# Altium project foxbms2-master.PrjPcb (part 5 of 7)

## Sheet io-devices.SchDoc
size A3; DocumentNumber: 15; SheetNumber: 15; SheetTotal: 45; SheetDescription: Smart Switches, Isolation Monitoring
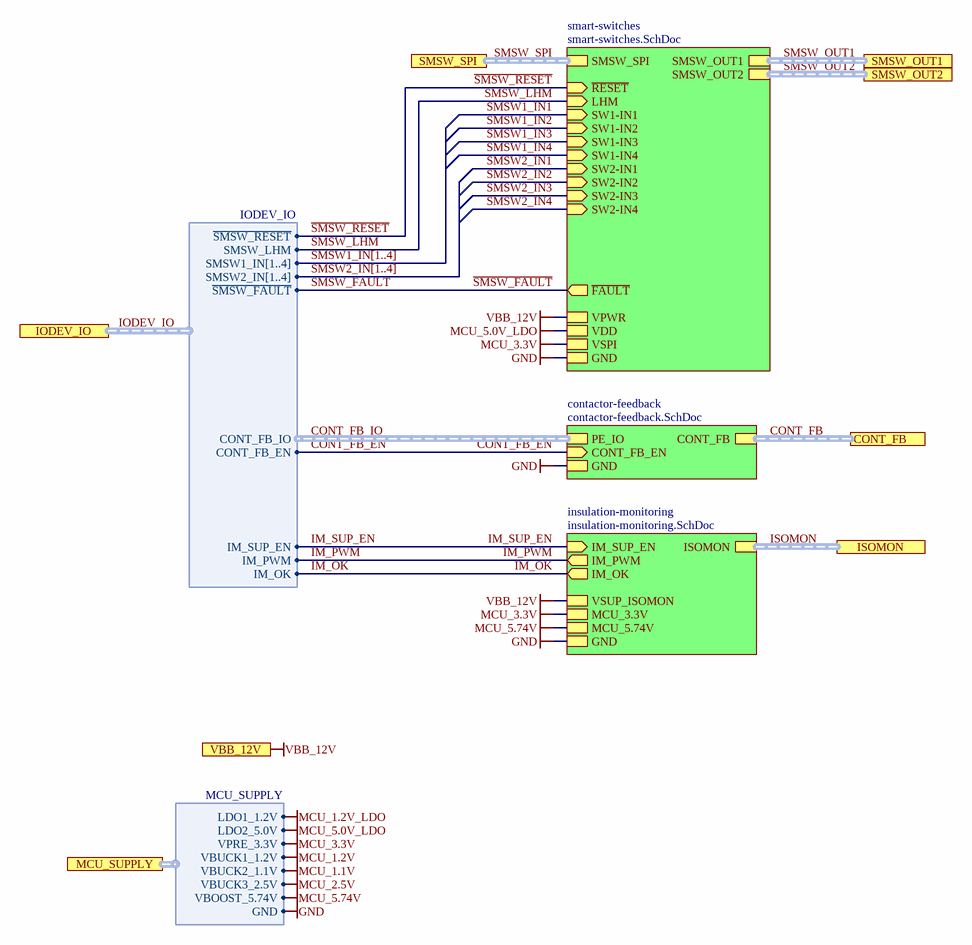
[diagram p16: io-devices.SchDoc]

### Sub-sheets
contactor-feedback = contactor-feedback.SchDoc (file not in this document): PE_IO (harness PE_IO), CONT_FB (harness PE_IO), GND, CONT_FB_EN (in)
insulation-monitoring = insulation-monitoring.SchDoc (file not in this document): GND, IM_SUP_EN (in), ISOMON (harness ISOMON), VSUP_ISOMON, IM_PWM (out), IM_OK (out), MCU_3.3V, MCU_5.74V
smart-switches = smart-switches.SchDoc (file not in this document): ~{RESET} (in), LHM (in), ~{FAULT} (out), SMSW_SPI (harness SPI), SMSW_OUT2 (harness SMSW_OUT), SMSW_OUT1 (harness SMSW_OUT), SW1-IN4 (in), SW2-IN2 (in), SW1-IN1 (in), SW2-IN3 (in), SW1-IN3 (in), SW1-IN2 (in), SW2-IN4 (in), SW2-IN1 (in), GND, VDD, VPWR, VSPI

### Ports
CONT_FB (harness PE_IO), IODEV_IO (harness IODEV_IO), ISOMON (harness ISOMON), MCU_SUPPLY (harness MCU_SUPPLY), SMSW_OUT1 (harness SMSW_OUT), SMSW_OUT2 (harness SMSW_OUT), SMSW_SPI (harness SPI), VBB_12V

### Harnesses
IODEV_IO: ~{SMSW_RESET}, SMSW_LHM, ~{SMSW_FAULT}, CONT_FB_IO, CONT_FB_EN, IM_SUP_EN, IM_PWM, IM_OK, SMSW1_IN[1..4], SMSW2_IN[1..4]
MCU_SUPPLY: VBUCK1_1.2V, VBUCK2_1.1V, VBUCK3_2.5V, LDO1_1.2V, LDO2_5.0V, GND, VPRE_3.3V, VBOOST_5.74V

### Nets
GND: sheet smart-switches/GND, sheet contactor-feedback/GND, sheet insulation-monitoring/GND, port MCU_SUPPLY.GND
MCU_3.3V: sheet smart-switches/VSPI, sheet insulation-monitoring/MCU_3.3V, port MCU_SUPPLY.VPRE_3.3V
MCU_5.0V_LDO: sheet smart-switches/VDD, port MCU_SUPPLY.LDO2_5.0V
MCU_5.74V: sheet insulation-monitoring/MCU_5.74V, port MCU_SUPPLY.VBOOST_5.74V
VBB_12V: port VBB_12V, sheet smart-switches/VPWR, sheet insulation-monitoring/VSUP_ISOMON
~{SMSW_FAULT}: sheet smart-switches/~{FAULT}, port IODEV_IO.~{SMSW_FAULT}  [project net IODEV_IO~{.}SMSW_FAULT]
~{SMSW_RESET}: sheet smart-switches/~{RESET}, port IODEV_IO.~{SMSW_RESET}  [project net IODEV_IO~{.}SMSW_RESET]
CONT_FB_EN: sheet contactor-feedback/CONT_FB_EN, port IODEV_IO.CONT_FB_EN  [project net IODEV_IO.CONT_FB_EN]
IM_OK: sheet insulation-monitoring/IM_OK, port IODEV_IO.IM_OK  [project net IODEV_IO.IM_OK]
IM_PWM: sheet insulation-monitoring/IM_PWM, port IODEV_IO.IM_PWM  [project net IODEV_IO.IM_PWM]
IM_SUP_EN: sheet insulation-monitoring/IM_SUP_EN, port IODEV_IO.IM_SUP_EN  [project net IODEV_IO.IM_SUP_EN]
SMSW_LHM: sheet smart-switches/LHM, port IODEV_IO.SMSW_LHM  [project net EXT_CON.SMSW_LHM]

### Buses and harness runs
bus SMSW1_IN[1..4]
bus SMSW2_IN[1..4]
harness CONT_FB = port CONT_FB = sheet contactor-feedback/CONT_FB
harness CONT_FB_IO = sheet contactor-feedback/PE_IO
harness IODEV_IO = port IODEV_IO
harness ISOMON = port ISOMON = sheet insulation-monitoring/ISOMON
harness SMSW_OUT1 = port SMSW_OUT1 = sheet smart-switches/SMSW_OUT1
harness SMSW_OUT2 = port SMSW_OUT2 = sheet smart-switches/SMSW_OUT2
harness SMSW_SPI = port SMSW_SPI = sheet smart-switches/SMSW_SPI

### Notes on the sheet
- Fraunhofer IISB
- Schottkystr. 10
- developed by:
- 91058 Erlangen
- Germany
- Author
- Project
- License
- Description
- File
- Version
- Release Date
- Sheet
- foxbms.org <https://foxbms.org>
- www.iisb.fraunhofer.de <https://www.iisb.fraunhofer.de/>
- foxBMS Team
- /

## Sheet supply.SchDoc
size A3; DocumentNumber: 41; SheetNumber: 41; SheetTotal: 45; SheetDescription: Board Power Supply
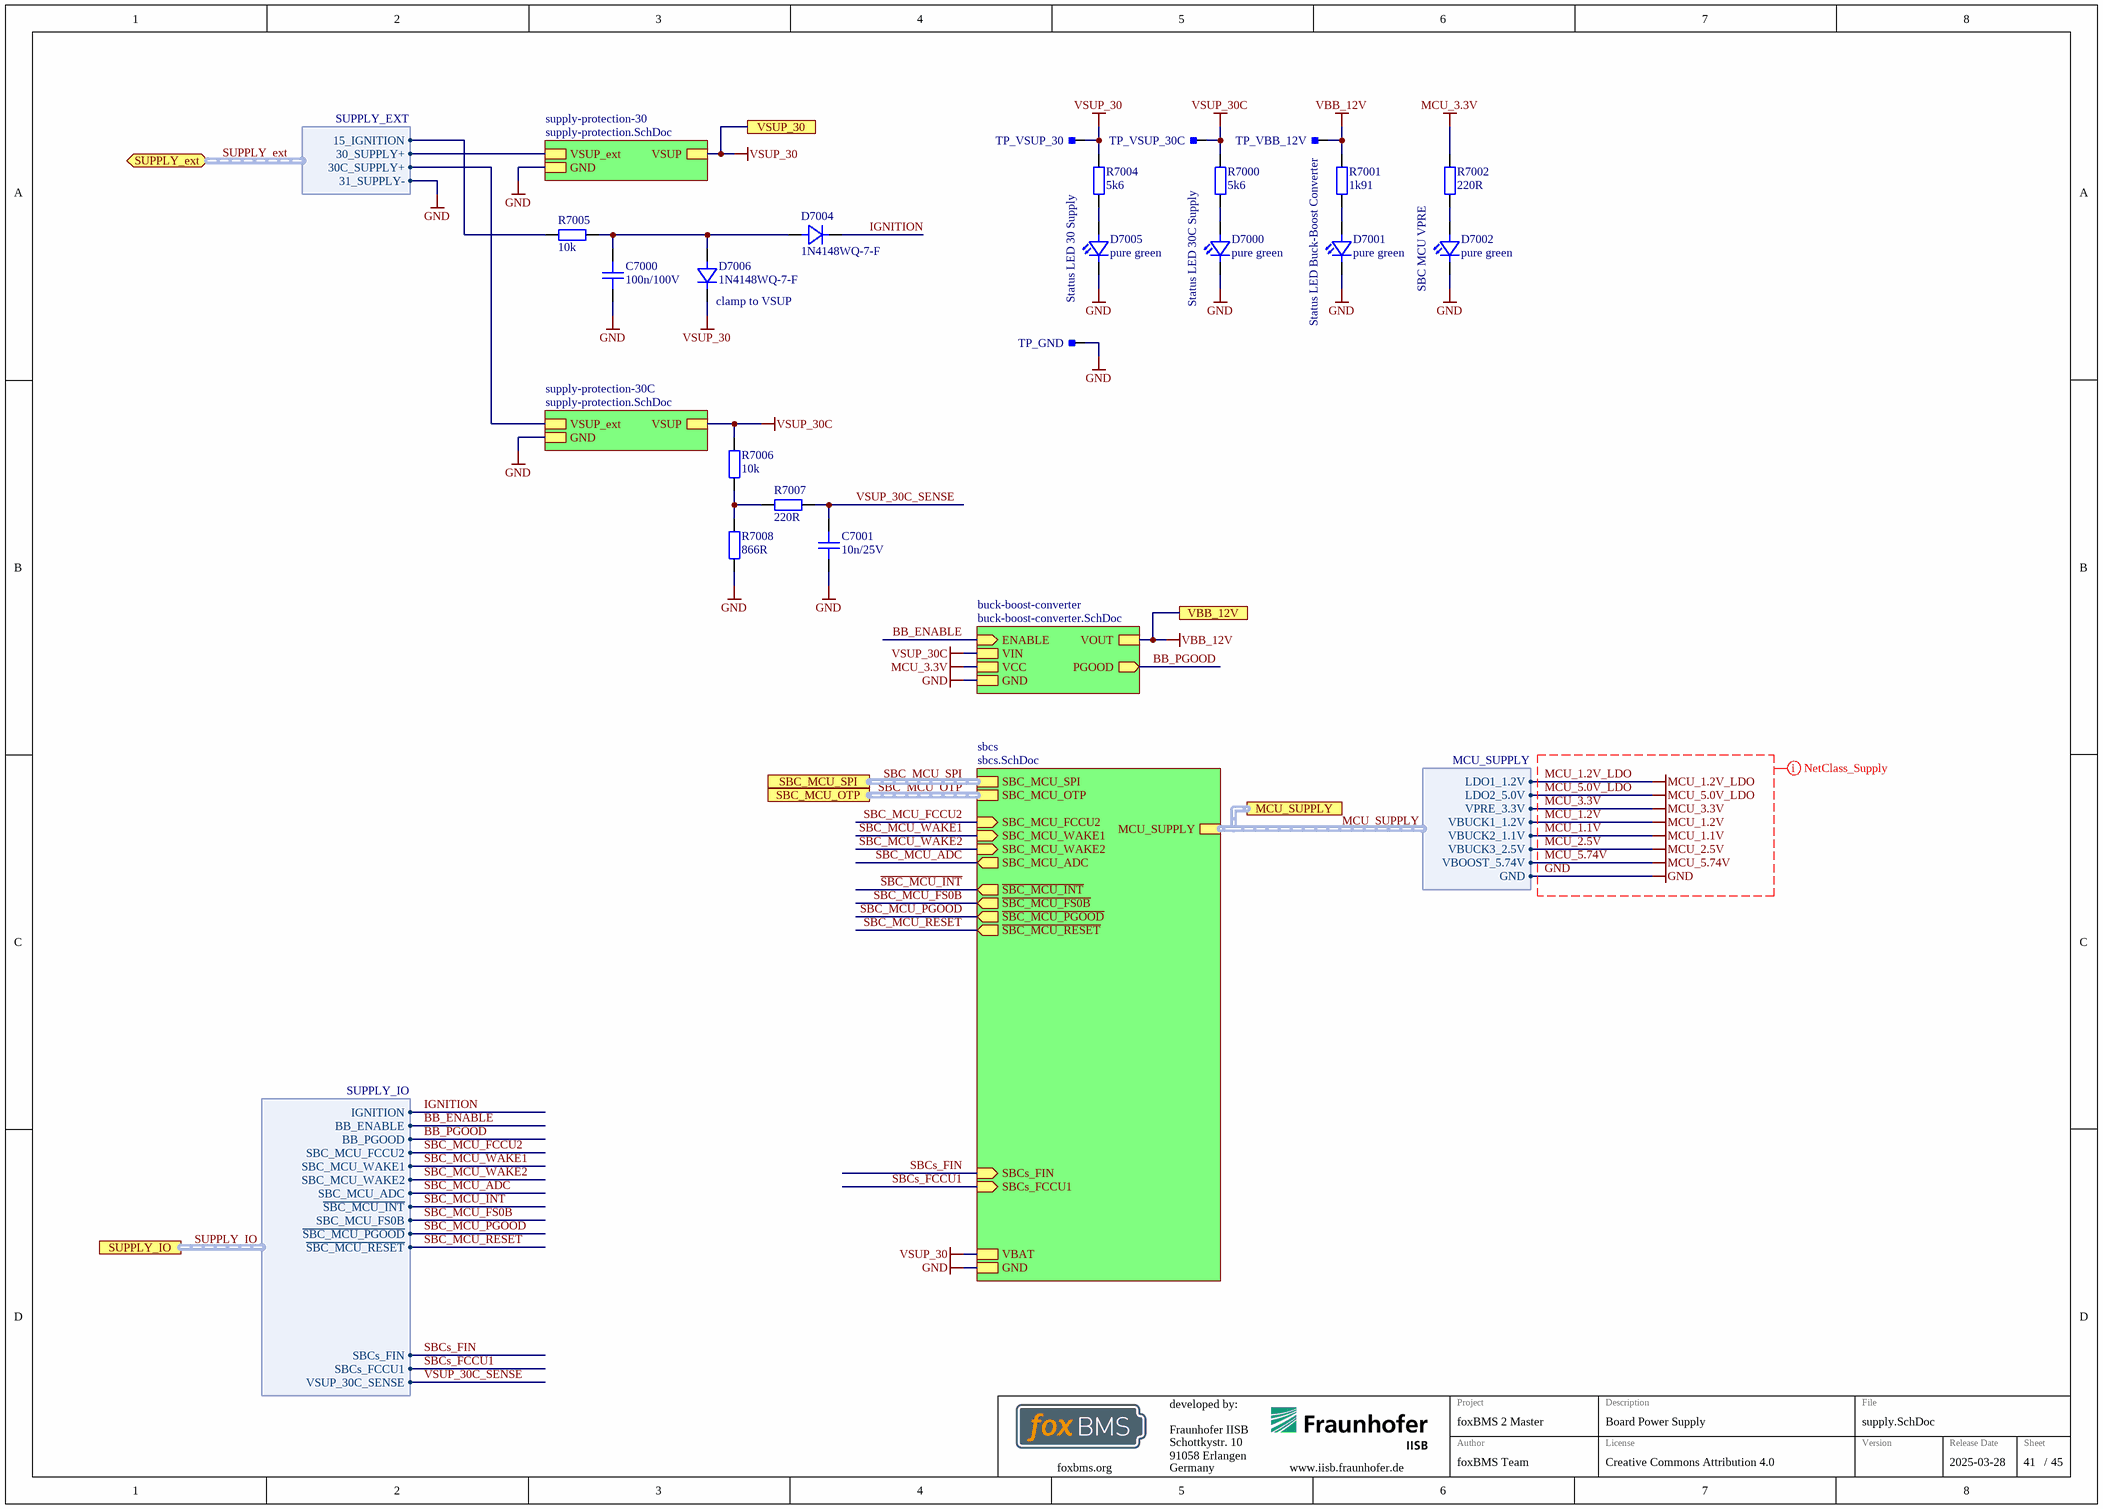
[diagram p17: supply.SchDoc]

### Parts
C7000  100n/100V  [CAPC1608X08N]
C7001  10n/25V  [CAPC1005X06N]
D7000  pure green  [LEDC1608X07N]
D7001  pure green  [LEDC1608X07N]
D7002  pure green  [LEDC1608X07N]
D7004  1N4148WQ-7-F  [SOD-123_CASE-425-04-ISSUE-G]
D7005  pure green  [LEDC1608X07N]
D7006  1N4148WQ-7-F  [SOD-123_CASE-425-04-ISSUE-G]
R7000  5k6  [RESC1005X04N]
R7001  1k91  [RESC1005X04N]
R7002  220R  [RESC1005X04N]
R7004  5k6  [RESC1005X04N]
R7005  10k  [RESC1005X04N]
R7006  10k  [RESC1005X04N]
R7007  220R  [RESC1005X04N]
R7008  866R  [RESC1005X04N]
TP_GND  Testpoint_Square  [Testpoint_S1]  (value not drawn)  (no BOM)
TP_VBB_12V  Testpoint_Square  [Testpoint_S1]  (value not drawn)  (no BOM)
TP_VSUP_30  Testpoint_Square  [Testpoint_S1]  (value not drawn)  (no BOM)
TP_VSUP_30C  Testpoint_Square  [Testpoint_S1]  (value not drawn)  (no BOM)

### Sub-sheets
buck-boost-converter = buck-boost-converter.SchDoc (file not in this document): VIN, VOUT, PGOOD (out), GND, VCC, ENABLE (in)
sbcs = sbcs.SchDoc: VBAT, GND, SBC_MCU_SPI (harness SPI), SBC_MCU_WAKE2 (in), SBC_MCU_FCCU2 (in), ~{SBC_MCU_FS0B} (out), SBC_MCU_ADC (out), ~{SBC_MCU_INT} (out), MCU_SUPPLY (harness MCU_SUPPLY), SBC_MCU_OTP (harness SBC_OTP), SBC_MCU_WAKE1 (in), SBCs_FIN (in), ~{SBC_MCU_PGOOD} (out), ~{SBC_MCU_RESET} (out), SBCs_FCCU1 (in)
supply-protection-30 = supply-protection.SchDoc (file not in this document): VSUP, GND, VSUP_ext
supply-protection-30C = supply-protection.SchDoc (file not in this document): VSUP, GND, VSUP_ext

### Ports
MCU_SUPPLY (harness MCU_SUPPLY), SBC_MCU_OTP (harness SBC_OTP), SBC_MCU_SPI (harness SPI), SUPPLY_ext (bidir, harness SUPPLY_EXT), SUPPLY_IO (harness SUPPLY_IO), VBB_12V, VSUP_30

### Harnesses
MCU_SUPPLY: VBUCK1_1.2V, VBUCK2_1.1V, VBUCK3_2.5V, LDO1_1.2V, LDO2_5.0V, GND, VPRE_3.3V, VBOOST_5.74V
SUPPLY_IO: IGNITION, BB_ENABLE, BB_PGOOD, SBC_MCU_FCCU2, SBC_MCU_WAKE1, SBC_MCU_WAKE2, SBC_MCU_ADC, ~{SBC_MCU_INT}, SBC_MCU_FS0B, ~{SBC_MCU_PGOOD}, ~{SBC_MCU_RESET}, SBCs_FIN, SBCs_FCCU1, VSUP_30C_SENSE
SUPPLY_EXT: 30_SUPPLY+, 31_SUPPLY-, 15_IGNITION, 30C_SUPPLY+

### Nets
GND: C7000.1 C7001.1 D7000.1(C) D7001.1(C) D7002.1(C) D7005.1(C) R7008.1 TP_GND.1 ; sheet buck-boost-converter/GND, sheet supply-protection-30/GND, sheet sbcs/GND, sheet supply-protection-30C/GND, port MCU_SUPPLY.GND, port SUPPLY_ext.31_SUPPLY-
MCU_3.3V: R7002.2 ; sheet buck-boost-converter/VCC, port MCU_SUPPLY.VPRE_3.3V
VBB_12V: R7001.2 TP_VBB_12V.1 ; port VBB_12V, sheet buck-boost-converter/VOUT
VSUP_30: D7006.1(K) R7004.2 TP_VSUP_30.1 ; port VSUP_30, sheet supply-protection-30/VSUP, sheet sbcs/VBAT
VSUP_30C: R7000.2 R7006.2 TP_VSUP_30C.1 ; sheet buck-boost-converter/VIN, sheet supply-protection-30C/VSUP
~{SBC_MCU_INT}: sheet sbcs/~{SBC_MCU_INT}, port SUPPLY_IO.~{SBC_MCU_INT}  [project net MCU_GIOA.0]
~{SBC_MCU_PGOOD}: sheet sbcs/~{SBC_MCU_PGOOD}, port SUPPLY_IO.~{SBC_MCU_PGOOD}  [project net EXT_CON~{.}SBC_MCU_PGOOD]
~{SBC_MCU_RESET}: sheet sbcs/~{SBC_MCU_RESET}, port SUPPLY_IO.~{SBC_MCU_RESET}  [project net EXT_CON~{.}SBC_MCU_RESET]
BB_ENABLE: sheet buck-boost-converter/ENABLE, port SUPPLY_IO.BB_ENABLE  [project net MCU_GIOX.T6]
BB_PGOOD: sheet buck-boost-converter/PGOOD, port SUPPLY_IO.BB_PGOOD  [project net MCU_GIOB.7]
IGNITION: D7004.1(K) ; sheet sbcs/SBC_MCU_WAKE1, port SUPPLY_IO.IGNITION, port SUPPLY_IO.SBC_MCU_WAKE1  [also labelled SBC_MCU_WAKE1]  [project net SUPPLY_IO.IGNITION]
SBC_MCU_ADC: sheet sbcs/SBC_MCU_ADC, port SUPPLY_IO.SBC_MCU_ADC  [project net SUPPLY_IO.SBC_MCU_ADC]
SBC_MCU_FCCU2: sheet sbcs/SBC_MCU_FCCU2, port SUPPLY_IO.SBC_MCU_FCCU2  [project net MCU_GIOX.T7]
SBC_MCU_FS0B: sheet sbcs/~{SBC_MCU_FS0B}, port SUPPLY_IO.SBC_MCU_FS0B  [project net EXT_CON.SBC_MCU_FS0B]
SBC_MCU_WAKE2: sheet sbcs/SBC_MCU_WAKE2, port SUPPLY_IO.SBC_MCU_WAKE2  [project net SUPPLY_IO.SBC_MCU_WAKE2]
SBCs_FCCU1: sheet sbcs/SBCs_FCCU1, port SUPPLY_IO.SBCs_FCCU1  [project net MCU_RST~{.}ERROR]
SBCs_FIN: sheet sbcs/SBCs_FIN, port SUPPLY_IO.SBCs_FIN  [project net MCU_CLK.2.22MHz]
SUPPLY_ext.15_IGNITION: R7005.2 ; port SUPPLY_ext.15_IGNITION
SUPPLY_ext.30_SUPPLY+: sheet supply-protection-30/VSUP_ext, port SUPPLY_ext.30_SUPPLY+
SUPPLY_ext.30C_SUPPLY+: sheet supply-protection-30C/VSUP_ext, port SUPPLY_ext.30C_SUPPLY+
VSUP_30C_SENSE: C7001.2 R7007.2 ; port SUPPLY_IO.VSUP_30C_SENSE  [project net SUPPLY_IO.VSUP_30C_SENSE]
NetC7000_2: C7000.2 D7004.2(A) D7006.2(A) R7005.1
NetD7000_2: D7000.2(A) R7000.1
NetD7001_2: D7001.2(A) R7001.1
NetD7002_2: D7002.2(A) R7002.1
NetD7005_2: D7005.2(A) R7004.1
NetR7006_1: R7006.1 R7007.1 R7008.2

### Buses and harness runs
harness MCU_SUPPLY = port MCU_SUPPLY = sheet sbcs/MCU_SUPPLY
harness SBC_MCU_OTP = port SBC_MCU_OTP = sheet sbcs/SBC_MCU_OTP
harness SBC_MCU_SPI = port SBC_MCU_SPI = sheet sbcs/SBC_MCU_SPI
harness SUPPLY_ext = port SUPPLY_ext
harness SUPPLY_IO = port SUPPLY_IO

### Layout directives
net class Supply_All: GND, MCU_1.1V, MCU_1.2V, MCU_1.2V_LDO, MCU_2.5V, MCU_3.3V, MCU_5.0V_LDO, MCU_5.74V

### Notes on the sheet
- Status LED 30 Supply
- Status LED 30C Supply
- (near TP_VBB_12V) Status LED Buck-Boost Converter
- SBC MCU VPRE
- (near D7006) clamp to VSUP
- Fraunhofer IISB
- Schottkystr. 10
- developed by:
- 91058 Erlangen
- Germany
- Author
- Project
- License
- Description
- File
- Version
- Release Date
- Sheet
- foxbms.org <https://foxbms.org>
- www.iisb.fraunhofer.de <https://www.iisb.fraunhofer.de/>
- foxBMS Team
- /

### Library data of the parts
C7000 = gen_C_ceramic_100n_100V_X7R_0603: MLCC; Capacitance: 100n; Rated Voltage: 100V; Dielectric: X7R; Case EIA: 0603; Case Metric: 1608; Automotive Qualified: True; PnP Package: 0603C; Part Number: gen_C_ceramic_100n_100V_X7R_0603; Supplier 1: Digikey; Supplier Part Number 1: 490-13420-1-ND; Supplier 2: Mouser; Supplier Part Number 2: 81-GCJ188R72A104KA1D
C7001 = gen_C_ceramic_10n_25V_X7R_0402: MLCC; Capacitance: 10n; Rated Voltage: 25V; Dielectric: X7R; Case EIA: 0402; Case Metric: 1005; PnP Package: 0402C; PnP Value: 10nF/25V/X7R; PnP equipped: x; Automotive Qualified: True; Part Number: gen_C_ceramic_10n_25V_X7R_0402; Supplier 1: Farnell; Supplier Part Number 1: 2210793
D7000-D7002 D7005 = LED_0603_pure_green_AECQ: TLMP1100-GS08; Manufacturer: Vishay; Breakdown Voltage: 5V; Continuous Forward Current: 20mA; Forward Voltage @ 20mA: 2.1V; Automotive Qualified: True; Part Number: LED_0603_pure_green_AECQ; Color: pure green; Operating Temperature: -40°C - 100°C; ComponentLink1Description: Datasheet; ComponentLink1URL: http://www.farnell.com/datasheets/2049164.pdf; Supplier 1: Farnell; Supplier Part Number 1: 1328306; Supplier 2: Digikey; Supplier Part Number 2: 751-1176-1-ND; PnP Package: LED_0603
D7004 D7006 = 1N4148WQ-7-F: Diode; Manufacturer: Diodes Inc.; Breakdown Voltage: 100V; Continuous Forward Current: 300mA; PnP Package: SOD123; Automotive Qualified: True; Part Number: 1N4148WQ-7-F; Part Name: 1N4148WQ-7-F; Operating Temperature: -65°C - +150°C; ComponentLink1Description: Datasheet; ComponentLink1URL: https://www.diodes.com/assets/Datasheets/ds30086.pdf; Supplier 1: Digikey; Supplier Part Number 1: 1N4148WQ-7-FDICT-ND
R7000 R7004 = gen_R_5k6_0402: SMD Resistor 5k6 0402; Tolerance: 1%; Power: 0.063W; Case EIA: 0402; Case Metric: 1005; Maximum Working Voltage: 50V; PnP Package: 0402R; Automotive Qualified: True; AEC-Q Norm: AEC-Q200; AEC-Q Grade: Grade 0; Part Number: gen_R_5k6_0402; Operating Temperature: -55°C - +155°C; Resistance: 5k6; Series: E24; PnP Value: 5k6; Supplier 1: Digikey; Supplier Part Number 1: A129636CT-ND; ECCN: EAR99
R7001 = gen_R_1k91_0402: SMD Resistor 1k91 0402; Tolerance: 1%; Power: 0.063W; Case EIA: 0402; Case Metric: 1005; Maximum Working Voltage: 50V; PnP Package: 0402R; Automotive Qualified: True; AEC-Q Grade: Grade 0; AEC-Q Norm: AEC-Q200; Part Number: gen_R_1k91_0402; Operating Temperature: -55°C - +155°C; Resistance: 1k91; Series: E96; PnP Value: 1k91; ECCN: EAR99; Supplier 1: Digikey; Supplier Part Number 1: P1.91KLCT-ND
R7002 = gen_R_220R_0402: SMD Resistor 220R 0402; Tolerance: 1%; Power: 0.063W; Case EIA: 0402; Case Metric: 1005; Maximum Working Voltage: 50V; PnP Package: 0402R; Automotive Qualified: True; AEC-Q Norm: AEC-Q200; AEC-Q Grade: Grade 0; Part Number: gen_R_220R_0402; Operating Temperature: -55°C - +155°C; Resistance: 220R; Series: E24; PnP Value: 220R; Supplier 1: Digikey; Supplier Part Number 1: A129619CT-ND; ECCN: EAR99
R7005 = gen_R_10k_0402: SMD Resistor 10k 0402; Tolerance: 1%; Power: 0.063W; Case EIA: 0402; Case Metric: 1005; Maximum Working Voltage: 50V; PnP Package: 0402R; PnP equipped: x; Automotive Qualified: True; AEC-Q Norm: AEC-Q200; Part Number: gen_R_10k_0402; Operating Temperature: -55°C - +155°C; Resistance: 10k; Series: E24, E96; PnP Value: 10k; Supplier 1: Farnell; Supplier Part Number 1: 2059239; ECCN: EAR99
R7006 = gen_R_10k_0402: SMD Resistor 10k 0402; Tolerance: 1%; Power: 0.063W; Case EIA: 0402; Case Metric: 1005; Maximum Working Voltage: 50V; PnP Package: 0402R; Automotive Qualified: True; AEC-Q Norm: AEC-Q200; PnP equipped: x; Part Number: gen_R_10k_0402; Operating Temperature: -55°C - +155°C; Resistance: 10k; Series: E24, E96; PnP Value: 10k; ECCN: EAR99; Supplier 1: Farnell; Supplier Part Number 1: 2059239
R7007 = gen_R_220R_0402: SMD Resistor 220R 0402; Tolerance: 1%; Power: 0.063W; Case EIA: 0402; Case Metric: 1005; Maximum Working Voltage: 50V; PnP Package: 0402R; Automotive Qualified: True; AEC-Q Grade: Grade 0; AEC-Q Norm: AEC-Q200; Part Number: gen_R_220R_0402; Operating Temperature: -55°C - +155°C; Resistance: 220R; Series: E24; PnP Value: 220R; ECCN: EAR99; Supplier 1: Digikey; Supplier Part Number 1: A129619CT-ND
R7008 = gen_R_866R_0402: SMD Resistor 866R 0402; Tolerance: 1%; Power: 0.063W; Case EIA: 0402; Case Metric: 1005; Maximum Working Voltage: 50V; PnP Package: 0402R; Automotive Qualified: True; AEC-Q Grade: Grade 0; AEC-Q Norm: AEC-Q200; Part Number: gen_R_866R_0402; Operating Temperature: -55°C - +155°C; Resistance: 866R; Series: E96; PnP Value: 866R; ECCN: EAR99; Supplier 1: Farnell; Supplier Part Number 1: 2302631
TP_GND TP_VBB_12V TP_VSUP_30 TP_VSUP_30C = Testpoint_Square: Testpoint, square; Automotive Qualified: False; Part Number: Testpoint_Square

## Sheet sbcs.SchDoc
size A3; DocumentNumber: 43; SheetNumber: 43; SheetTotal: 45; SheetDescription: System basic chips for MCU and peripherals
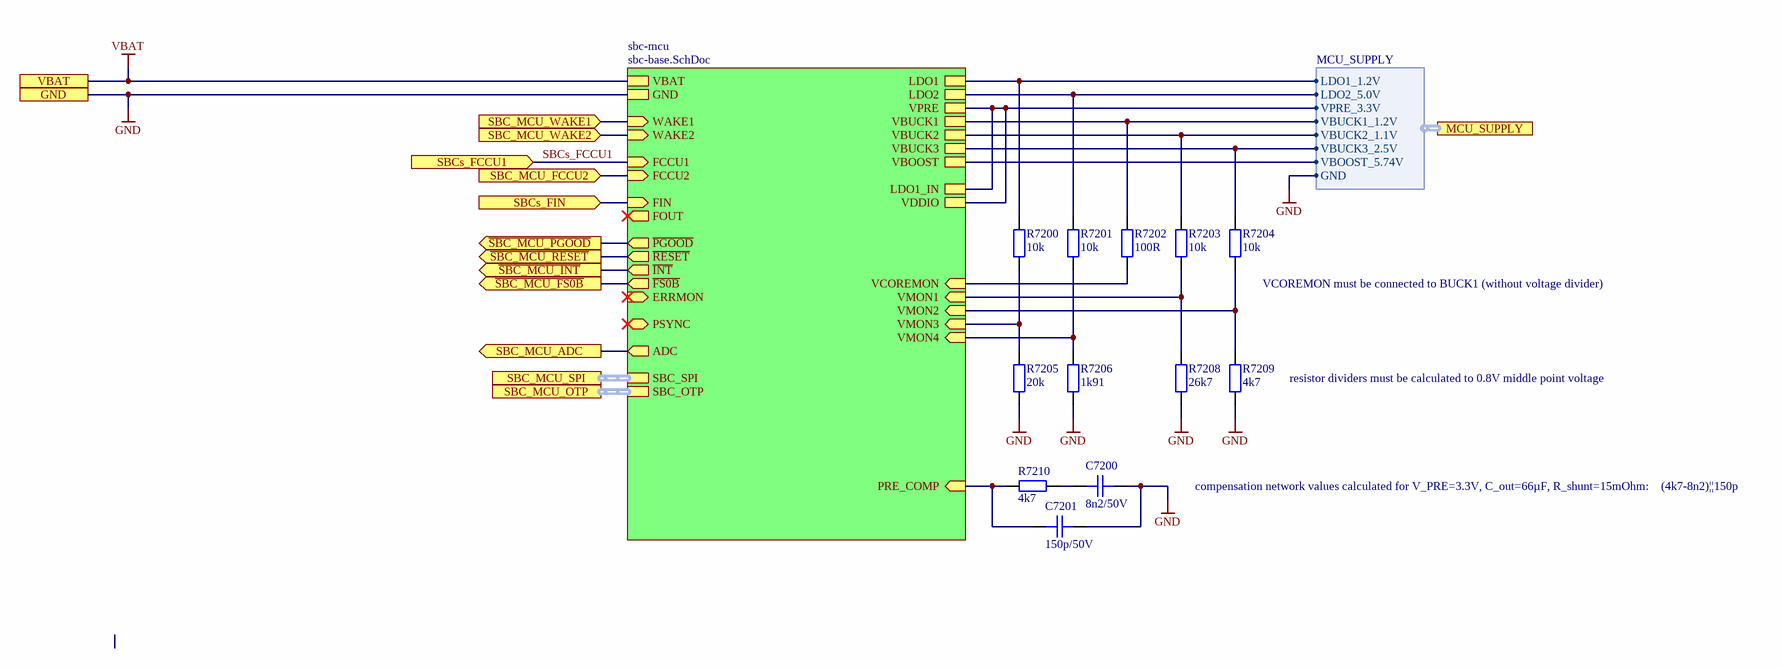
[diagram p18: sbcs.SchDoc]

### Parts
C7200  8n2/50V  [CAPC1608X08N]
C7201  150p/50V  [CAPC1005X06N]
R7200  10k  [RESC1005X04N]
R7201  10k  [RESC1005X04N]
R7202  100R  [RESC1005X04N]
R7203  10k  [RESC1005X04N]
R7204  10k  [RESC1005X04N]
R7205  20k  [RESC1005X04N]
R7206  1k91  [RESC1005X04N]
R7208  26k7  [RESC1005X04N]
R7209  4k7  [RESC1005X04N]
R7210  4k7  [RESC1005X04N]

### Sub-sheets
sbc-mcu = sbc-base.SchDoc: ERRMON (in), FCCU1 (in), ~{FS0B} (out), ~{INT} (out), WAKE2 (in), VBAT, GND, ~{PGOOD} (out), ~{RESET} (out), FOUT (out), ADC (out), FCCU2 (in), PSYNC (bidir), SBC_OTP (harness SBC_OTP), VBUCK3, FIN (in), LDO2, VPRE, VBUCK1, VBUCK2, VCOREMON (in), VMON1 (in), VMON2 (in), VDDIO, LDO1_IN, PRE_COMP (in), VMON3 (in), VBOOST, SBC_SPI (harness SPI), LDO1, VMON4 (in), WAKE1 (in)

### Ports
GND, MCU_SUPPLY (harness MCU_SUPPLY), SBC_MCU_ADC (out), SBC_MCU_FCCU2 (in), SBC_MCU_OTP (harness SBC_OTP), SBC_MCU_SPI (harness SPI), SBC_MCU_WAKE1 (in), SBC_MCU_WAKE2 (in), SBCs_FCCU1 (in), SBCs_FIN (in), VBAT, ~{SBC_MCU_FS0B} (out), ~{SBC_MCU_INT} (out), ~{SBC_MCU_PGOOD} (out), ~{SBC_MCU_RESET} (out)

### Harnesses
MCU_SUPPLY: VBUCK1_1.2V, VBUCK2_1.1V, VBUCK3_2.5V, LDO1_1.2V, LDO2_5.0V, GND, VPRE_3.3V, VBOOST_5.74V

### Nets
GND: C7200.2 C7201.2 R7205.1 R7206.1 R7208.1 R7209.1 ; port GND, sheet sbc-mcu/GND, port MCU_SUPPLY.GND
MCU_1.1V: R7203.2 ; sheet sbc-mcu/VBUCK2, port MCU_SUPPLY.VBUCK2_1.1V
MCU_1.2V: R7202.2 ; sheet sbc-mcu/VBUCK1, port MCU_SUPPLY.VBUCK1_1.2V
MCU_1.2V_LDO: R7200.2 ; sheet sbc-mcu/LDO1, port MCU_SUPPLY.LDO1_1.2V
MCU_2.5V: R7204.2 ; sheet sbc-mcu/VBUCK3, port MCU_SUPPLY.VBUCK3_2.5V
MCU_3.3V: sheet sbc-mcu/VPRE, sheet sbc-mcu/VDDIO, sheet sbc-mcu/LDO1_IN, port MCU_SUPPLY.VPRE_3.3V
MCU_5.0V_LDO: R7201.2 ; sheet sbc-mcu/LDO2, port MCU_SUPPLY.LDO2_5.0V
MCU_5.74V: sheet sbc-mcu/VBOOST, port MCU_SUPPLY.VBOOST_5.74V
VBAT: port VBAT, sheet sbc-mcu/VBAT  [project net VSUP_30]
EXT_CON~{.}SBC_MCU_PGOOD: port ~{SBC_MCU_PGOOD}, sheet sbc-mcu/~{PGOOD}
EXT_CON~{.}SBC_MCU_RESET: port ~{SBC_MCU_RESET}, sheet sbc-mcu/~{RESET}
EXT_CON.SBC_MCU_FS0B: port ~{SBC_MCU_FS0B}, sheet sbc-mcu/~{FS0B}
MCU_CLK.2.22MHz: port SBCs_FIN, sheet sbc-mcu/FIN
MCU_GIOA.0: port ~{SBC_MCU_INT}, sheet sbc-mcu/~{INT}
MCU_GIOX.T7: port SBC_MCU_FCCU2, sheet sbc-mcu/FCCU2
SBCs_FCCU1: port SBCs_FCCU1, sheet sbc-mcu/FCCU1  [project net MCU_RST~{.}ERROR]
SUPPLY_IO.IGNITION: port SBC_MCU_WAKE1, sheet sbc-mcu/WAKE1
SUPPLY_IO.SBC_MCU_ADC: port SBC_MCU_ADC, sheet sbc-mcu/ADC
SUPPLY_IO.SBC_MCU_WAKE2: port SBC_MCU_WAKE2, sheet sbc-mcu/WAKE2
VCOREMON: R7202.1 ; sheet sbc-mcu/VCOREMON
VMON1: R7203.1 R7208.2 ; sheet sbc-mcu/VMON1
VMON2: R7204.1 R7209.2 ; sheet sbc-mcu/VMON2
VMON3: R7200.1 R7205.2 ; sheet sbc-mcu/VMON3
VMON4: R7201.1 R7206.2 ; sheet sbc-mcu/VMON4
NetC7200_1: C7200.1 R7210.1
NetC7201_1: C7201.1 R7210.2 ; sheet sbc-mcu/PRE_COMP

### Buses and harness runs
harness port SBC_MCU_OTP = sheet sbc-mcu/SBC_OTP
harness port SBC_MCU_SPI = sheet sbc-mcu/SBC_SPI

### Notes on the sheet
- (near R7204) VCOREMON must be connected to BUCK1 (without voltage divider)
- resistor dividers must be calculated to 0.8V middle point voltage
- compensation network values calculated for V_PRE=3.3V, C_out=66µF, R_shunt=15mOhm:
- (4k7-8n2)||150p
- Fraunhofer IISB
- Schottkystr. 10
- developed by:
- 91058 Erlangen
- Germany
- Author
- Project
- License
- Description
- File
- Version
- Release Date
- Sheet
- foxbms.org <https://foxbms.org>
- www.iisb.fraunhofer.de <https://www.iisb.fraunhofer.de/>
- foxBMS Team
- /

### Library data of the parts
C7200 = gen_C_ceramic_8n2_50V_C0G_0603: MLCC; Capacitance: 8n2; Rated Voltage: 50V; Dielectric: C0G; Case EIA: 0603; Case Metric: 1608; Automotive Qualified: True; PnP Package: 0603C; Part Number: gen_C_ceramic_8n2_50V_C0G_0603; Supplier 1: Digikey; Supplier Part Number 1: 445-8114-1-ND
C7201 = gen_C_ceramic_150p_50V_C0G_0402: MLCC; Capacitance: 150p; Rated Voltage: 50V; Dielectric: C0G; Case EIA: 0402; Case Metric: 1005; Automotive Qualified: True; PnP Package: 0402C; Part Number: gen_C_ceramic_150p_50V_C0G_0402; Supplier 1: Digikey; Supplier Part Number 1: 490-4926-1-ND
R7200 R7201 R7203 R7204 = gen_R_10k_0402: SMD Resistor 10k 0402; Tolerance: 1%; Power: 0.063W; Case EIA: 0402; Case Metric: 1005; Maximum Working Voltage: 50V; PnP Package: 0402R; Automotive Qualified: True; PnP equipped: x; AEC-Q Norm: AEC-Q200; Part Number: gen_R_10k_0402; Operating Temperature: -55°C - +155°C; Resistance: 10k; Series: E24, E96; PnP Value: 10k; Supplier 1: Farnell; Supplier Part Number 1: 2059239; ECCN: EAR99
R7202 = gen_R_100R_0402: SMD Resistor 100R 0402; Tolerance: 1%; Power: 0.063W; Case EIA: 0402; Case Metric: 1005; Maximum Working Voltage: 50V; PnP Package: 0402R; Automotive Qualified: True; PnP equipped: x; AEC-Q Norm: AEC-Q200; Part Number: gen_R_100R_0402; Operating Temperature: -55°C - +155°C; Resistance: 100R; Series: E24, E96; PnP Value: 100R; Supplier 1: Farnell; Supplier Part Number 1: 2302528; ECCN: EAR99
R7205 = gen_R_20k_0402: SMD Resistor 20k 0402; Tolerance: 1%; Power: 0.063W; Case EIA: 0402; Case Metric: 1005; Maximum Working Voltage: 50V; PnP Package: 0402R; Automotive Qualified: True; PnP equipped: x; AEC-Q Norm: AEC-Q200; Part Number: gen_R_20k_0402; Operating Temperature: -55°C - +155°C; Resistance: 20k; Series: E24, E96; PnP Value: 20k; Supplier 1: Farnell; Supplier Part Number 1: 2059242; Supplier 2: Farnell; Supplier Part Number 2: 2059160; ECCN: EAR99
R7206 = gen_R_1k91_0402: as R7001 on sheet supply; Part Number: gen_R_1k91_0402; Operating Temperature: -55°C - +155°C; Resistance: 1k91; Series: E96; PnP Value: 1k91; ECCN: EAR99; Supplier 1: Digikey; Supplier Part Number 1: P1.91KLCT-ND
R7208 = gen_R_26k7_0402: SMD Resistor 26k7 0402; Tolerance: 1%; Power: 0.063W; Case EIA: 0402; Case Metric: 1005; Maximum Working Voltage: 50V; PnP Package: 0402R; Automotive Qualified: True; AEC-Q Grade: Grade 0; AEC-Q Norm: AEC-Q200; Part Number: gen_R_26k7_0402; Operating Temperature: -55°C - +155°C; Resistance: 26k7; Series: E96; PnP Value: 26k7; ECCN: EAR99; Supplier 1: Digikey; Supplier Part Number 1: P26.7KLCT-ND
R7209 R7210 = gen_R_4k7_0402: SMD Resistor 4k7 0402; Tolerance: 1%; Power: 0.063W; Case EIA: 0402; Case Metric: 1005; Maximum Working Voltage: 50V; PnP Package: 0402R; Automotive Qualified: True; PnP equipped: x; Part Number: gen_R_4k7_0402; Operating Temperature: -55°C - +155°C; Resistance: 4k7; Series: E24; PnP Value: 4k7; Supplier 1: Farnell; Supplier Part Number 1: 2302707

## Sheet sbc-base.SchDoc
size A3; DocumentNumber: 44; SheetNumber: 44; SheetTotal: 45; SheetDescription: System basic chip for MCU
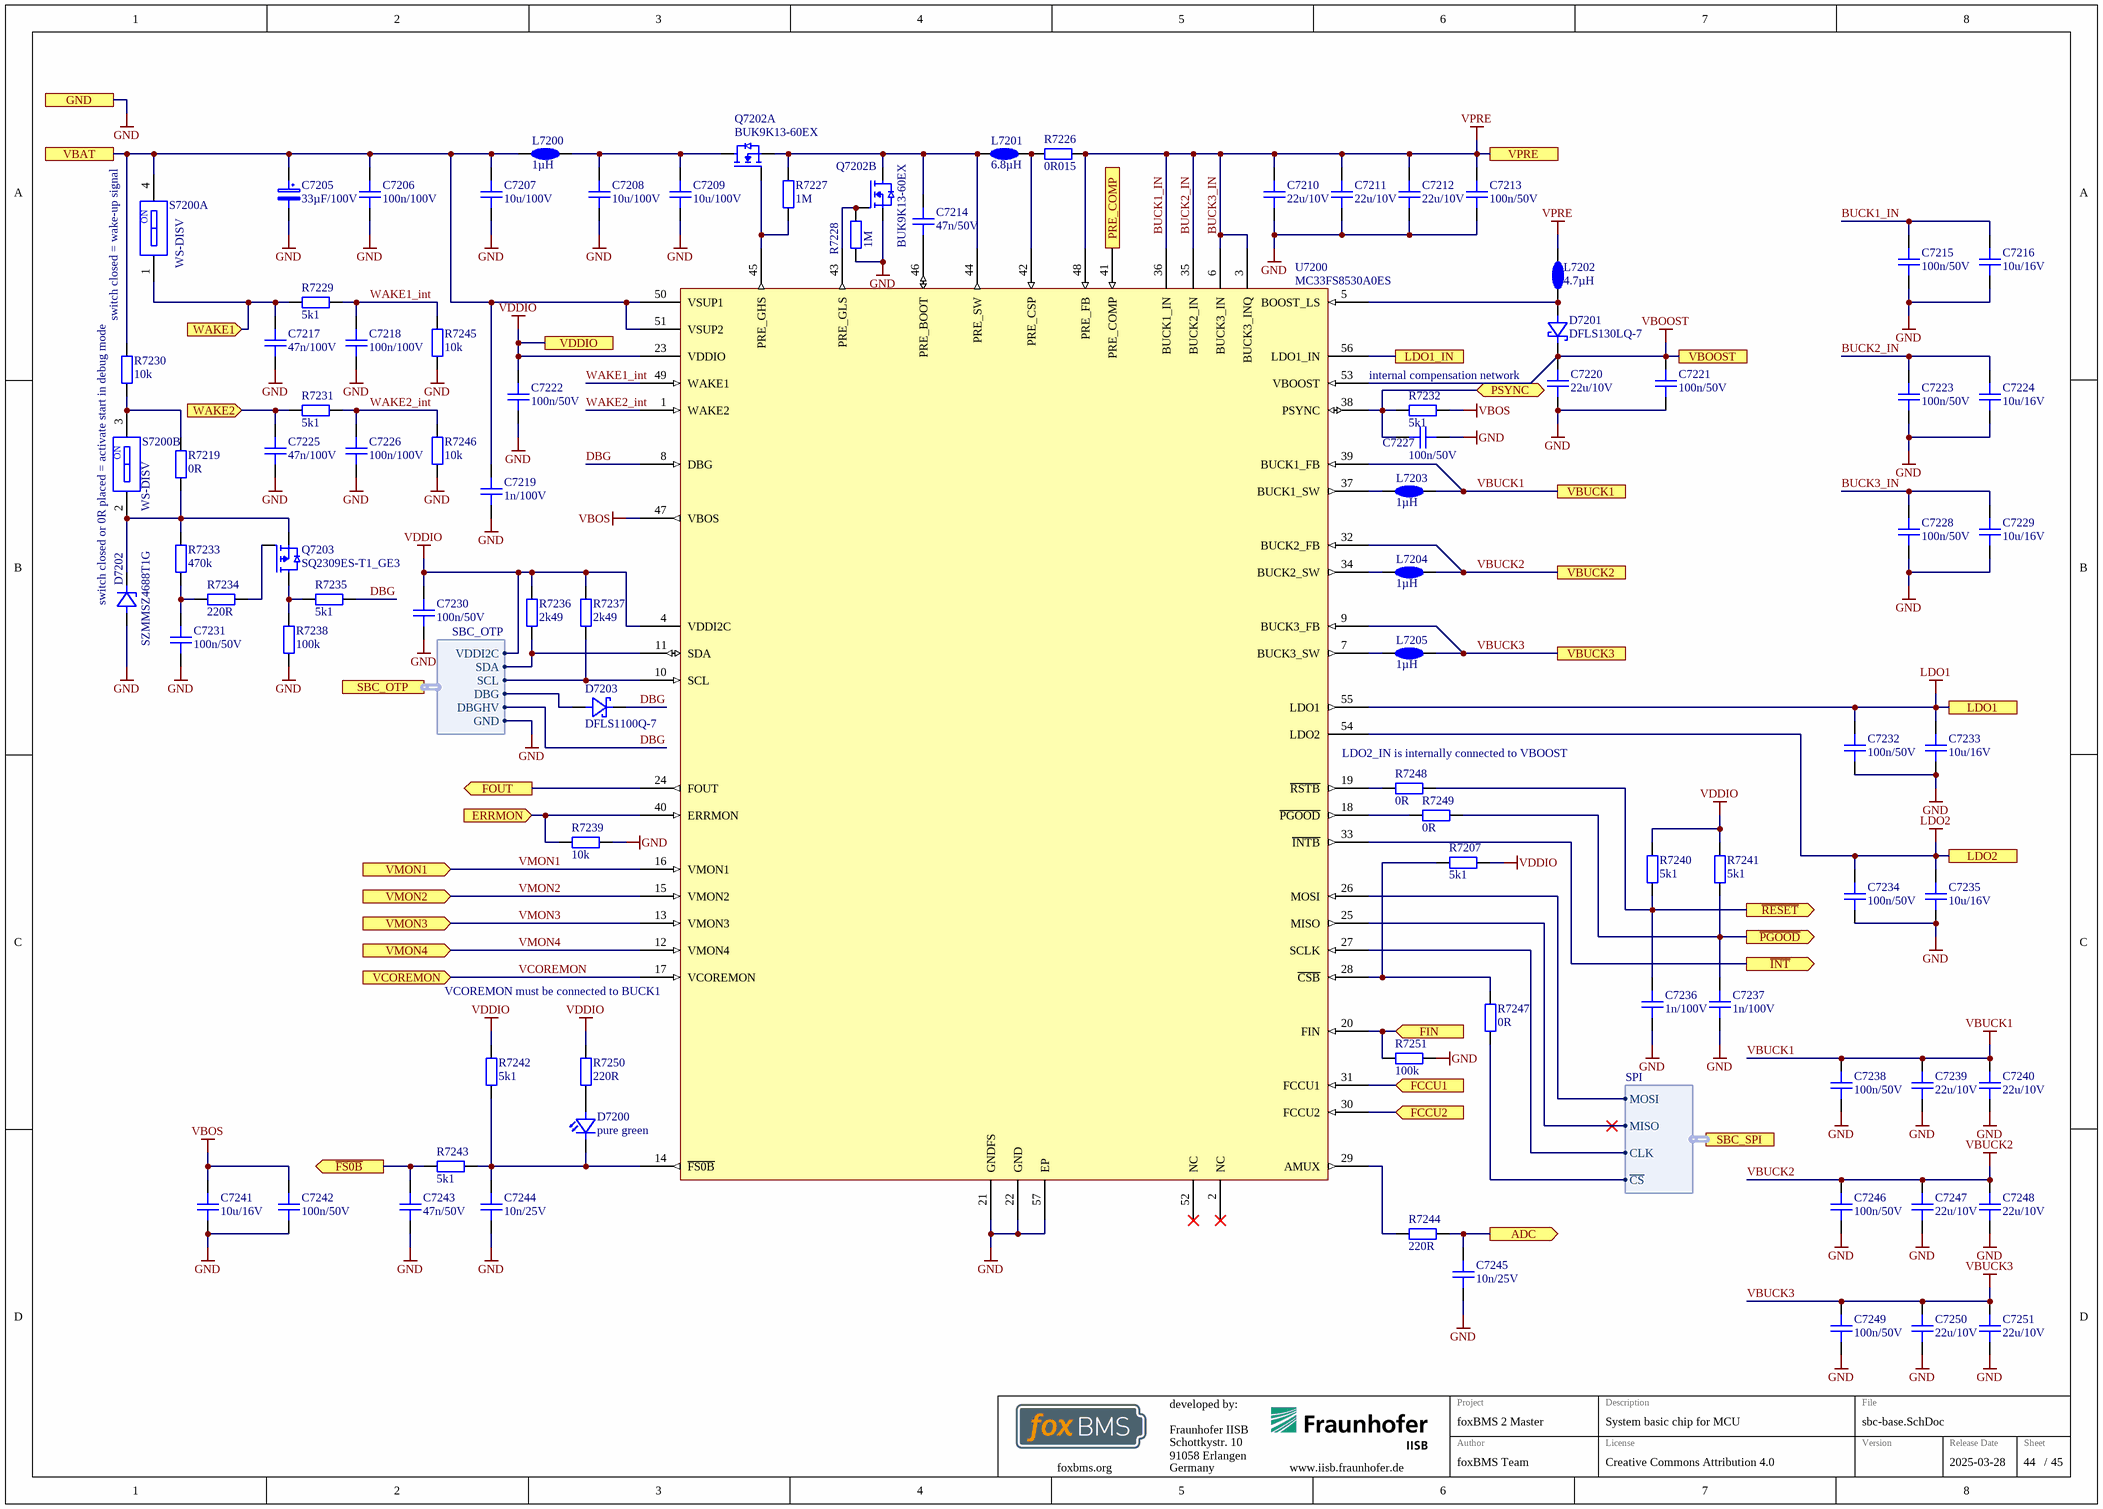
[diagram p19: sbc-base.SchDoc]

### Parts
C7205  33µF/100V  [ELECTROLYTIC_CAP_PANASONIC_G]
C7206  100n/100V  [CAPC1608X08N]
C7207  10u/100V  [CAPC5750X28N]
C7208  10u/100V  [CAPC5750X28N]
C7209  10u/100V  [CAPC5750X28N]
C7210  22u/10V  [CAPC3216X18N]
C7211  22u/10V  [CAPC3216X18N]
C7212  22u/10V  [CAPC3216X18N]
C7213  100n/50V  [CAPC1005X06N]
C7214  47n/50V  [CAPC1005X06N]
C7215  100n/50V  [CAPC1005X06N]
C7216  10u/16V  [CAPC2012X14N]
C7217  47n/100V  [CAPC1608X08N]
C7218  100n/100V  [CAPC1608X08N]
C7219  1n/100V  [CAPC1005X06N]
C7220  22u/10V  [CAPC3216X18N]
C7221  100n/50V  [CAPC1005X06N]
C7222  100n/50V  [CAPC1005X06N]
C7223  100n/50V  [CAPC1005X06N]
C7224  10u/16V  [CAPC2012X14N]
C7225  47n/100V  [CAPC1608X08N]
C7226  100n/100V  [CAPC1608X08N]
C7227  100n/50V  [CAPC1005X06N]
C7228  100n/50V  [CAPC1005X06N]
C7229  10u/16V  [CAPC2012X14N]
C7230  100n/50V  [CAPC1005X06N]
C7231  100n/50V  [CAPC1005X06N]
C7232  100n/50V  [CAPC1005X06N]
C7233  10u/16V  [CAPC2012X14N]
C7234  100n/50V  [CAPC1005X06N]
C7235  10u/16V  [CAPC2012X14N]
C7236  1n/100V  [CAPC1005X06N]
C7237  1n/100V  [CAPC1005X06N]
C7238  100n/50V  [CAPC1005X06N]
C7239  22u/10V  [CAPC3216X18N]
C7240  22u/10V  [CAPC3216X18N]
C7241  10u/16V  [CAPC2012X14N]
C7242  100n/50V  [CAPC1005X06N]
C7243  47n/50V  [CAPC1005X06N]
C7244  10n/25V  [CAPC1005X06N]
C7245  10n/25V  [CAPC1005X06N]
C7246  100n/50V  [CAPC1005X06N]
C7247  22u/10V  [CAPC3216X18N]
C7248  22u/10V  [CAPC3216X18N]
C7249  100n/50V  [CAPC1005X06N]
C7250  22u/10V  [CAPC3216X18N]
C7251  22u/10V  [CAPC3216X18N]
D7200  pure green  [LEDC1608X07N]
D7201  DFLS130LQ-7  [PowerDI123]
D7202  SZMMSZ4688T1G  [SOD-123_CASE-425-04-ISSUE-G]
D7203  DFLS1100Q-7  [PowerDI123]
L7200  1µH  [ASPIAIG-S4035]
L7201  6.8µH  [PA4342.XXXNLT_Footprint_2]
L7202  4.7µH  [ASPIAIG-S4035]
L7203  1µH  [TDK_TFM252012]
L7204  1µH  [TDK_TFM252012]
L7205  1µH  [TDK_TFM252012]
Q7202  BUK9K13-60EX  [NXP-SOT1205_N]  (parts A,B of 2)
Q7203  SQ2309ES-T1_GE3  [SOT95P237X110-3N]
R7207  5k1  [RESC1005X04N]
R7219  0R  [RESC1005X04N]
R7226  0R015  [PANASONIC_ERJ-B1]
R7227  1M  [RESC1005X04N]
R7228  1M  [RESC1005X04N]
R7229  5k1  [RESC1005X04N]
R7230  10k  [RESC1005X04N]
R7231  5k1  [RESC1005X04N]
R7232  5k1  [RESC1005X04N]
R7233  470k  [RESC1005X04N]
R7234  220R  [RESC1005X04N]
R7235  5k1  [RESC1005X04N]
R7236  2k49  [RESC1005X04N]
R7237  2k49  [RESC1005X04N]
R7238  100k  [RESC1005X04N]
R7239  10k  [RESC1005X04N]
R7240  5k1  [RESC1005X04N]
R7241  5k1  [RESC1005X04N]
R7242  5k1  [RESC1005X04N]
R7243  5k1  [RESC1005X04N]
R7244  220R  [RESC1005X04N]
R7245  10k  [RESC1005X04N]
R7246  10k  [RESC1005X04N]
R7247  0R  [RESC1005X04N]
R7248  0R  [RESC1005X04N]
R7249  0R  [RESC1005X04N]
R7250  220R  [RESC1005X04N]
R7251  100k  [RESC1005X04N]
S7200  WS-DISV  [WE_416131160802]  (parts A,B of 2)
U7200  MC33FS8530A0ES  [MC33FS8530A0ES]

### Ports
ADC (out), ERRMON (in), FCCU1 (in), FCCU2 (in), FIN (in), FOUT (out), GND, LDO1, LDO1_IN, LDO2, PRE_COMP (in), PSYNC (bidir), SBC_OTP (harness SBC_OTP), SBC_SPI (harness SPI), VBAT, VBOOST, VBUCK1, VBUCK2, VBUCK3, VCOREMON (in), VDDIO, VMON1 (in), VMON2 (in), VMON3 (in), VMON4 (in), VPRE, WAKE1 (in), WAKE2 (in), ~{FS0B} (out), ~{INT} (out), ~{PGOOD} (out), ~{RESET} (out)

### Harnesses
SBC_OTP: VDDI2C, SDA, SCL, GND, DBG, DBGHV
SPI: CLK, MOSI, MISO, ~{CS}

### Nets
BUCK1_IN: C7210.2 C7211.2 C7212.2 C7213.2 C7215.2 C7216.2 C7222.2 C7223.2 C7224.2 C7228.2 C7229.2 C7230.2 L7202.2 R7207.1 R7226.2 R7236.2 R7237.2 R7240.2 R7241.2 R7242.2 R7250.2 U7200.3(BUCK3_INQ) U7200.4(VDDI2C) U7200.6(BUCK3_IN) U7200.23(VDDIO) U7200.35(BUCK2_IN) U7200.36(BUCK1_IN) U7200.48(PRE_FB) U7200.56(LDO1_IN) ; port VDDIO, port LDO1_IN, port VPRE, port SBC_OTP.VDDI2C  [also labelled BUCK2_IN, BUCK3_IN, VDDIO, VPRE]  [project net MCU_3.3V]
GND: C7205.2 C7206.1 C7207.1 C7208.1 C7209.1 C7210.1 C7211.1 C7212.1 C7213.1 C7215.1 C7216.1 C7217.1 C7218.1 C7219.1 C7220.1 C7221.1 C7222.1 C7223.1 C7224.1 C7225.1 C7226.1 C7227.1 C7228.1 C7229.1 C7230.1 C7231.1 C7232.1 C7233.1 C7234.1 C7235.1 C7236.1 C7237.1 C7238.1 C7239.1 C7240.1 C7241.1 C7242.1 C7243.1 C7244.1 C7245.1 C7246.1 C7247.1 C7248.1 C7249.1 C7250.1 C7251.1 D7202.2(A) Q7202.3(S) R7228.1 R7238.1 R7239.1 R7245.2 R7246.2 R7251.2 U7200.21(GNDFS) U7200.22(GND) U7200.57(EP) ; port GND, port SBC_OTP.GND
LDO1: C7232.2 C7233.2 U7200.55(LDO1) ; port LDO1  [project net MCU_1.2V_LDO]
LDO2: C7234.2 C7235.2 U7200.54(LDO2) ; port LDO2  [project net MCU_5.0V_LDO]
VBOOST: C7220.2 C7221.2 D7201.1(K) U7200.53(VBOOST) ; port VBOOST  [project net MCU_5.74V]
VBOS: C7241.2 C7242.2 R7232.2 U7200.47(VBOS)
VBUCK1: C7238.2 C7239.2 C7240.2 L7203.2 U7200.39(BUCK1_FB) ; port VBUCK1  [project net MCU_1.2V]
VBUCK2: C7246.2 C7247.2 C7248.2 L7204.2 U7200.32(BUCK2_FB) ; port VBUCK2  [project net MCU_1.1V]
VBUCK3: C7249.2 C7250.2 C7251.2 L7205.2 U7200.9(BUCK3_FB) ; port VBUCK3  [project net MCU_2.5V]
VSUP_30: C7205.1 C7206.2 C7207.2 C7219.2 L7200.1 R7230.2 S7200.4 U7200.50(VSUP1) U7200.51(VSUP2) ; port VBAT
DBG: D7203.1(K) R7235.1 U7200.8(DBG) ; port SBC_OTP.DBGHV  [project net SBC_MCU_OTP.DBGHV]
EXT_CON~{.}SBC_MCU_PGOOD: C7237.2 R7241.1 R7249.2 ; port ~{PGOOD}
EXT_CON~{.}SBC_MCU_RESET: C7236.2 R7240.1 R7248.1 ; port ~{RESET}
EXT_CON.SBC_MCU_FS0B: C7243.2 R7243.2 ; port ~{FS0B}
MCU_CLK.2.22MHz: R7251.1 U7200.20(FIN) ; port FIN
MCU_GIOA.0: U7200.33(~{INTB}) ; port ~{INT}
MCU_GIOX.T7: U7200.30(FCCU2) ; port FCCU2
MCU_RST~{.}ERROR: U7200.31(FCCU1) ; port FCCU1
MCU_SPI2~{.}CS0: R7247.1 ; port SBC_SPI.~{CS}
MCU_SPI2.CLK: U7200.27(SCLK) ; port SBC_SPI.CLK
MCU_SPI2.SIMO: U7200.26(MOSI) ; port SBC_SPI.MOSI
MCU_SPI2.SOMI: U7200.25(MISO) ; port SBC_SPI.MISO
SBC_MCU_OTP.DBG: D7203.2(A) ; port SBC_OTP.DBG
SBC_MCU_OTP.SCL: R7237.1 U7200.10(SCL) ; port SBC_OTP.SCL
SBC_MCU_OTP.SDA: R7236.1 U7200.11(SDA) ; port SBC_OTP.SDA
SUPPLY_IO.IGNITION: C7217.2 R7229.2 S7200.1 ; port WAKE1
SUPPLY_IO.SBC_MCU_ADC: C7245.2 R7244.2 ; port ADC
SUPPLY_IO.SBC_MCU_WAKE2: C7225.2 R7231.2 ; port WAKE2
VCOREMON: U7200.17(VCOREMON) ; port VCOREMON
VMON1: U7200.16(VMON1) ; port VMON1
VMON2: U7200.15(VMON2) ; port VMON2
VMON3: U7200.13(VMON3) ; port VMON3
VMON4: U7200.12(VMON4) ; port VMON4
WAKE1_int: C7218.2 R7229.1 R7245.1 U7200.49(WAKE1)  [project net WAKE1_int_44]
WAKE2_int: C7226.2 R7231.1 R7246.1 U7200.1(WAKE2)  [project net WAKE2_int_44]
NetC7201_1: U7200.41(PRE_COMP) ; port PRE_COMP
NetC7208_2: C7208.2 C7209.2 L7200.2 Q7202.7(D)
NetC7214_1: C7214.1 U7200.46(PRE_BOOT)
NetC7214_2: C7214.2 L7201.1 Q7202.1(S) Q7202.5(D) R7227.2 U7200.44(PRE_SW)
NetC7227_2: C7227.2 R7232.1 U7200.38(PSYNC) ; port PSYNC
NetC7231_2: C7231.2 R7233.1 R7234.1
NetC7244_2: C7244.2 D7200.1(C) R7242.1 R7243.1 U7200.14(~{FS0B})
NetD7200_2: D7200.2(A) R7250.1
NetD7201_2: D7201.2(A) L7202.1 U7200.5(BOOST_LS)
NetD7202_1: D7202.1(K) Q7203.S R7219.1 R7233.2 S7200.2
NetL7201_2: L7201.2 R7226.1 U7200.42(PRE_CSP)
NetL7203_1: L7203.1 U7200.37(BUCK1_SW)
NetL7204_1: L7204.1 U7200.34(BUCK2_SW)
NetL7205_1: L7205.1 U7200.7(BUCK3_SW)
NetQ7202_2: Q7202.2(G) R7227.1 U7200.45(PRE_GHS)
NetQ7202_4: Q7202.4(G) R7228.2 U7200.43(PRE_GLS)
NetQ7203_D: Q7203.D R7235.2 R7238.2
NetQ7203_G: Q7203.G R7234.2
NetR7207_2: R7207.2 R7247.2 U7200.28(~{CSB})
NetR7219_2: R7219.2 R7230.1 S7200.3
NetR7239_2: R7239.2 U7200.40(ERRMON) ; port ERRMON
NetR7244_1: R7244.1 U7200.29(AMUX)
NetR7248_2: R7248.2 U7200.19(~{RSTB})
NetR7249_1: R7249.1 U7200.18(~{PGOOD})
NetU7200_24: U7200.24(FOUT) ; port FOUT

Not connected (* = marked no-connect by the designer): U7200 2(NC)* 52(NC)*

### Notes on the sheet
- (near R7230) switch closed = wake-up signal
- (near C7220) internal compensation network
- switch closed or 0R placed = activate start in debug mode
- (near U7200) LDO2_IN is internally connected to VBOOST
- (near U7200) VCOREMON must be connected to BUCK1
- Fraunhofer IISB
- Schottkystr. 10
- developed by:
- 91058 Erlangen
- Germany
- Author
- Project
- License
- Description
- File
- Version
- Release Date
- Sheet
- foxbms.org <https://foxbms.org>
- www.iisb.fraunhofer.de <https://www.iisb.fraunhofer.de/>
- foxBMS Team
- /
- (in symbol WE_416131160802, part A) ON
- (in symbol WE_416131160802, part B) ON

### Library data of the parts
C7205 = EEE-TG2A330P: SMD Electrolytic Capacitor; Capacitance: 33µF; Rated Voltage: 100V; Tolerance: +-20%; Heigth: 10.5mm; Automotive Qualified: True; Part Number: EEE-TG2A330P; Operating Temperature: -40°C to 125°C; Diameter: 10mm; ComponentLink1Description: Datasheet; ComponentLink1URL: https://industrial.panasonic.com/cdbs/www-data/pdf/RDE0000/ABA0000C1187.pdf; Supplier 1: Digikey; Supplier Part Number 1: PCE4126CT-ND
C7206 C7218 C7226 = gen_C_ceramic_100n_100V_X7R_0603: as C7000 on sheet supply; Part Number: gen_C_ceramic_100n_100V_X7R_0603; Supplier 1: Digikey; Supplier Part Number 1: 490-13420-1-ND; Supplier 2: Mouser; Supplier Part Number 2: 81-GCJ188R72A104KA1D
C7207-C7209 = gen_C_ceramic_10u_100V_X7S_2220: MLCC; Capacitance: 10u; Rated Voltage: 100V; Dielectric: X7S; Case EIA: 2220; Case Metric: 5750; Automotive Qualified: True; AEC-Q Grade: Grade 0; AEC-Q Norm: AEC-Q200; Part Number: gen_C_ceramic_10u_100V_X7S_2220; Supplier 1: Digikey; Supplier Part Number 1: 445-13152-1-ND; ECCN: EAR99
C7210-C7212 C7220 C7239 C7240 C7247 C7248 C7250 C7251 = gen_C_ceramic_22u_10V_X7R_1206: MLCC; Capacitance: 22u; Rated Voltage: 10V; Dielectric: X7R; Case EIA: 1206; Case Metric: 3216; Automotive Qualified: True; Part Number: gen_C_ceramic_22u_10V_X7R_1206; Supplier 1: Digikey; Supplier Part Number 1: 587-4243-1-ND
C7213 C7215 C7221-C7223 C7227 C7228 C7230-C7232 C7234 C7238 C7242 C7246 C7249 = gen_C_ceramic_100n_50V_X7R_0402: MLCC; Capacitance: 100n; Rated Voltage: 50V; Dielectric: X7R; Case EIA: 0402; Case Metric: 1005; PnP Package: 0402C; PnP Value: 100nF/50V/X7R; PnP equipped: x; Automotive Qualified: True; AEC-Q Norm: AEC-Q200; Part Number: gen_C_ceramic_100n_50V_X7R_0402; Supplier 1: Farnell; Supplier Part Number 1: 2210822; ECCN: EAR99
C7214 C7243 = gen_C_ceramic_47n_50V_X7R_0402: MLCC; Capacitance: 47n; Rated Voltage: 50V; Dielectric: X7R; Case EIA: 0402; Case Metric: 1005; Automotive Qualified: True; PnP Package: 0402C; Part Number: gen_C_ceramic_47n_50V_X7R_0402; Supplier 1: Farnell; Supplier Part Number 1: 2210827
C7216 C7224 C7229 C7233 C7235 C7241 = gen_C_ceramic_10u_16V_X7R_0805: MLCC; Capacitance: 10u; Rated Voltage: 16V; Dielectric: X7S; Case EIA: 0805; Case Metric: 2012; Automotive Qualified: True; AEC-Q Grade: Grade 1; AEC-Q Norm: AEC-Q200; Part Number: gen_C_ceramic_10u_16V_X7R_0805; ECCN: EAR99; Supplier 1: Digikey; Supplier Part Number 1: 445-16110-1-ND
C7217 C7225 = gen_C_ceramic_47n_100V_X7R_0603: MLCC; Capacitance: 47n; Rated Voltage: 100V; Dielectric: X7R; Case EIA: 0603; Case Metric: 1608; Automotive Qualified: True; PnP Package: 0603C; Part Number: gen_C_ceramic_47n_100V_X7R_0603; Supplier 1: Farnell; Supplier Part Number 1: 2478249; Supplier 2: Farnell; Supplier Part Number 2: 2708699; Supplier 3: Farnell; Supplier Part Number 3: 2905110
C7219 C7236 C7237 = gen_C_ceramic_1n_100V_X7R_0402: MLCC; Capacitance: 1n; Rated Voltage: 100V; Dielectric: X7R; Case EIA: 0402; Case Metric: 1005; Automotive Qualified: True; PnP Package: 0402C; Part Number: gen_C_ceramic_1n_100V_X7R_0402; Supplier 1: Digikey; Supplier Part Number 1: 490-4764-1-ND
C7244 C7245 = gen_C_ceramic_10n_25V_X7R_0402: as C7001 on sheet supply; Part Number: gen_C_ceramic_10n_25V_X7R_0402; Supplier 1: Farnell; Supplier Part Number 1: 2210793
D7200 = LED_0603_pure_green_AECQ: as D7000-D7002 on sheet supply; Part Number: LED_0603_pure_green_AECQ; Color: pure green; Operating Temperature: -40°C - 100°C; ComponentLink1Description: Datasheet; ComponentLink1URL: http://www.farnell.com/datasheets/2049164.pdf; Supplier 1: Farnell; Supplier Part Number 1: 1328306; Supplier 2: Digikey; Supplier Part Number 2: 751-1176-1-ND; PnP Package: LED_0603
D7201 = DFLS130LQ-7: Schottky Diode; Manufacturer: Diodes Inc.; Breakdown Voltage: 30V; Continuous Forward Current: 1A; Automotive Qualified: True; Part Number: DFLS130LQ-7; Part Name: DFLS130LQ-7; Operating Temperature: −40°C - +125°C; ComponentLink1Description: Datasheet; ComponentLink1URL: https://www.diodes.com/assets/Datasheets/DFLS130LQ.pdf; Supplier 1: Digikey; Supplier Part Number 1: DFLS130LQ-7DICT-ND
D7202 = SZMMSZ4688T1G: Zener Diode; Manufacturer: ON Semiconductor; Breakdown Voltage: 4.7V; PnP Package: SOD123; Automotive Qualified: True; Part Number: SZMMSZ4688T1G; Part Name: SZMMSZ4688T1G; Operating Temperature: -55°C - +150°C; ComponentLink1Description: Datasheet; ComponentLink1URL: https://www.onsemi.com/pub/Collateral/MMSZ4678T1-D.PDF; Supplier 1: Digikey; Supplier Part Number 1: SZMMSZ4688T1GOSCT-ND; Supplier 2: Farnell; Supplier Part Number 2: 2774579; Supplier 3: Mouser; Supplier Part Number 3: 863-SZMMSZ4688T1G
D7203 = DFLS1100Q-7: Schottky Diode; Manufacturer: Diodes Inc.; Breakdown Voltage: 100V; Continuous Forward Current: 1A; Automotive Qualified: True; Part Number: DFLS1100Q-7; Part Name: DFLS1100Q-7; Operating Temperature: −55°C - +175°C; ComponentLink1Description: Datasheet; ComponentLink1URL: https://www.diodes.com/assets/Datasheets/ds30497.pdf; Supplier 1: Mouser; Supplier Part Number 1: 621-DFLS1-100Q-7; Supplier 2: Digikey; Supplier Part Number 2: DFLS1100Q-7DICT-ND; Supplier 3: Farnell; Supplier Part Number 3: 3127293; PnP Package: POWERDI123
L7200 = ASPIAIG-S4035-1R0M-T: Power Inductor; Manufacturer: Abracon LLC; Rated Current: 4.5A; Saturation Current: 6.9A; Automotive Qualified: True; Part Number: ASPIAIG-S4035-1R0M-T; Operating Temperature: –40°C - +125°C; ComponentLink1Description: Datasheet; ComponentLink1URL: https://abracon.com/Magnetics/power/ASPIAIG-S4035.pdf; Inductance: 1µH; Supplier 1: Digikey; Supplier Part Number 1: 535-14223-1-ND; Supplier 2: Farnell; Supplier Part Number 2: 2848347
L7201 = PA4342.682NLT: Power Inductor; Manufacturer: Pulse; Rated Current: 8.5A; Saturation Current: 13.5A; Automotive Qualified: True; Part Number: PA4342.682NLT; Operating Temperature: -40°C - +125°C; ComponentLink1Description: Datasheet; ComponentLink1URL: https://www.mouser.de/datasheet/2/336/P769-1526786.pdf; Inductance: 6.8µH; Supplier 1: Digikey; Supplier Part Number 1: 553-3442-1-ND; Supplier 2: Mouser; Supplier Part Number 2: 673-PA4342.682NLT
L7202 = ASPIAIG-S4035-4R7M-T: Power Inductor; Manufacturer: Abracon LLC; Rated Current: 2.45A; Saturation Current: 3.2A; Automotive Qualified: True; Part Number: ASPIAIG-S4035-4R7M-T; Operating Temperature: –40°C - +125°C; ComponentLink1Description: Datasheet; ComponentLink1URL: https://abracon.com/Magnetics/power/ASPIAIG-S4035.pdf; Inductance: 4.7µH; Supplier 1: Digikey; Supplier Part Number 1: 535-14227-1-ND
L7203-L7205 = TFM252012ALMA1R0MTAA: Power Inductor; Manufacturer: TDK; Rated Current: 3.7A; Saturation Current: 4.2A; Automotive Qualified: True; Part Number: TFM252012ALMA1R0MTAA; Operating Temperature: –55°C - +150°C; ComponentLink1Description: Datasheet; ComponentLink1URL: https://product.tdk.com/info/en/catalog/datasheets/inductor_automotive_power_tfm252012alma_en.pdf; Inductance: 1µH; Supplier 1: Digikey; Supplier Part Number 1: 445-175183-1-ND
Q7202 = BUK9K13-60EX: Dual N-channel 60 V, 12.5 mΩ logic level MOSFET; Manufacturer: Nexperia; Maximum Drain-Source Voltage: 60V; Maximum Continous Drain Current (25°C): 40A; R_DS(on): 12.5m; Total Gate Charge: 7.9nC; Automotive Qualified: True; AEC-Q Norm: AEC-Q101; AEC-Q Grade: Grade 0; Part Number: BUK9K13-60EX; Part Name: BUK9K13-60EX; Operating Temperature: -55°C - +170°C; ComponentLink1Description: Datasheet; ComponentLink1URL: https://4donline.ihs.com/images/VipMasterIC/IC/NEXP/NEXP-S-A0003105620/NEXP-S-A0003105797-1.pdf?hkey=6D3A4C79FDBF58556ACFDE234799DDF0; Supplier 1: Digikey; Supplier Part Number 1: 1727-2467-1-ND; Supplier 2: Mouser; Supplier Part Number 2: 771-BUK9K13-60EX; Supplier 3: Farnell; Supplier Part Number 3: 3439704; ECCN: EAR99
Q7203 = SQ2309ES-T1_GE3: MOSFET-Transistor, p-channel, -1.7 A, -60 V; Manufacturer: Vishay; Maximum Drain-Source Voltage: 60V; Maximum Continous Drain Current (25°C): 1.7A; R_DS(on): 336m; Total Gate Charge: 8.5nC; Automotive Qualified: True; Part Number: SQ2309ES-T1_GE3; Part Name: PMOS; Operating Temperature: -55°C - +175°C; ComponentLink1Description: Datasheet; ComponentLink1URL: http://www.vishay.com/docs/67024/sq2309es.pdf; Supplier 1: Digikey; Supplier Part Number 1: SQ2309ES-T1_GE3CT-ND; Supplier 2: Farnell; Supplier Part Number 2: 2617108; Supplier 3: Mouser; Supplier Part Number 3: 781-SQ2309ES-T1_GE3
R7207 R7229 R7231 R7232 R7235 R7240-R7243 = gen_R_5k1_0402: SMD Resistor 5k1 0402; Tolerance: 1%; Power: 0.063W; Case EIA: 0402; Case Metric: 1005; Maximum Working Voltage: 50V; PnP Package: 0402R; PnP equipped: x; Automotive Qualified: True; AEC-Q Grade: Grade 0; AEC-Q Norm: AEC-Q200; Part Number: gen_R_5k1_0402; Operating Temperature: -55°C - +155°C; Resistance: 5k1; Series: E24; PnP Value: 5k1; ECCN: EAR99; Supplier 1: Farnell; Supplier Part Number 1: 2302709
R7219 R7247-R7249 = gen_R_0R_0402: SMD Resistor 0R 0402; Power: 0.063W; Case EIA: 0402; Case Metric: 1005; Maximum Working Voltage: 50V; PnP Package: 0402R; Automotive Qualified: True; AEC-Q Norm: AEC-Q200; PnP equipped: x; Part Number: gen_R_0R_0402; Operating Temperature: -55°C - +155°C; Resistance: 0R; Series: Jumper; PnP Value: 0R; Supplier 1: Farnell; Supplier Part Number 1: 1469661; Supplier 2: Farnell; Supplier Part Number 2: 2059190; ECCN: EAR99
R7226 = ERJ-B1CFR015U: SMD Shunt Resistor 0R015; Tolerance: 1%; Power: 2W; Case EIA: ERJ-B1; Maximum Working Voltage: 200V; Automotive Qualified: True; Part Number: ERJ-B1CFR015U; Operating Temperature: -55°C - +155°C; Resistance: 0R015; Supplier 1: Farnell; Supplier Part Number 1: 2294050; Supplier 2: Mouser; Supplier Part Number 2: 667-ERJ-B1CFR015U
R7227 R7228 = gen_R_1M_0402: SMD Resistor 1M 0402; Tolerance: 1%; Power: 0.063W; Case EIA: 0402; Case Metric: 1005; Maximum Working Voltage: 50V; PnP Package: 0402R; Automotive Qualified: True; AEC-Q Grade: Grade 0; AEC-Q Norm: AEC-Q200; Part Number: gen_R_1M_0402; Operating Temperature: -55°C - +155°C; Resistance: 1M; Series: E24, E96; PnP Value: 1M; ECCN: EAR99; Supplier 1: Digikey; Supplier Part Number 1: A129663CT-ND
R7230 R7245 R7246 = gen_R_10k_0402: as R7005 on sheet supply; Part Number: gen_R_10k_0402; Operating Temperature: -55°C - +155°C; Resistance: 10k; Series: E24, E96; PnP Value: 10k; Supplier 1: Farnell; Supplier Part Number 1: 2059239; ECCN: EAR99
R7233 = gen_R_470k_0402: SMD Resistor 470k 0402; Tolerance: 1%; Power: 0.063W; Case EIA: 0402; Case Metric: 1005; Maximum Working Voltage: 50V; PnP Package: 0402R; Automotive Qualified: True; Part Number: gen_R_470k_0402; Operating Temperature: -55°C - +155°C; Resistance: 470k; Series: E24; PnP Value: 470k; Supplier 1: Farnell; Supplier Part Number 1: 2302916
R7234 R7244 = gen_R_220R_0402: as R7007 on sheet supply; Part Number: gen_R_220R_0402; Operating Temperature: -55°C - +155°C; Resistance: 220R; Series: E24; PnP Value: 220R; ECCN: EAR99; Supplier 1: Digikey; Supplier Part Number 1: A129619CT-ND
R7236 R7237 = gen_R_2k49_0402: SMD Resistor 2k49 0402; Tolerance: 1%; Power: 0.063W; Case EIA: 0402; Case Metric: 1005; Maximum Working Voltage: 50V; PnP Package: 0402R; Automotive Qualified: True; Part Number: gen_R_2k49_0402; Operating Temperature: -55°C - +155°C; Resistance: 2k49; Series: E96; PnP Value: 2k49; Supplier 1: Farnell; Supplier Part Number 1: 2059135
R7238 R7251 = gen_R_100k_0402: SMD Resistor 100k 0402; Tolerance: 1%; Power: 0.063W; Case EIA: 0402; Case Metric: 1005; Maximum Working Voltage: 50V; PnP Package: 0402R; PnP equipped: x; Automotive Qualified: True; Part Number: gen_R_100k_0402; Operating Temperature: -55°C - +155°C; Resistance: 100k; Series: E24, E96; PnP Value: 100k; Supplier 1: Farnell; Supplier Part Number 1: 2302839
R7239 = gen_R_10k_0402: as R7200 on sheet sbcs; Part Number: gen_R_10k_0402; Operating Temperature: -55°C - +155°C; Resistance: 10k; Series: E24, E96; PnP Value: 10k; Supplier 1: Farnell; Supplier Part Number 1: 2059239; ECCN: EAR99
R7250 = gen_R_220R_0402: as R7002 on sheet supply; Part Number: gen_R_220R_0402; Operating Temperature: -55°C - +155°C; Resistance: 220R; Series: E24; PnP Value: 220R; Supplier 1: Digikey; Supplier Part Number 1: A129619CT-ND; ECCN: EAR99
S7200 = WE_416131160802: WS-DISV Small Compact SMT DipSwitch; Manufacturer: Würth Elektronik; Automotive Qualified: False; Part Number: WE_416131160802; Part Name: WS-DISV; Operating Temperature: -40°C - +85°C; ComponentLink1Description: Datasheet; ComponentLink1URL: https://www.we-online.de/katalog/datasheet/418121270802.pdf; Supplier 1: Digikey; Supplier Part Number 1: 732-3852-1-ND; Supplier 2: Mouser; Supplier Part Number 2: 710-416131160802
U7200 = MC33FS8530A0ES: Fail-safe system basis chip with multiple SMPS and LDO; Manufacturer: NXP; PnP Package: HPQFN-56; Automotive Qualified: True; AEC-Q Norm: AEC-Q100; AEC-Q Grade: Grade 1; Part Number: MC33FS8530A0ES; Part Name: MC33FS8530A0ES; Operating Temperature: −40°C - +125°C; Supplier 1: Mouser; Supplier Part Number 1: 771-MC33FS8530A0ES; Supplier 2: Digikey; Supplier Part Number 2: 568-MC33FS8530A0ES-ND; ECCN: EAR99